# EAGLE design sensors (EAGLE 6.4)
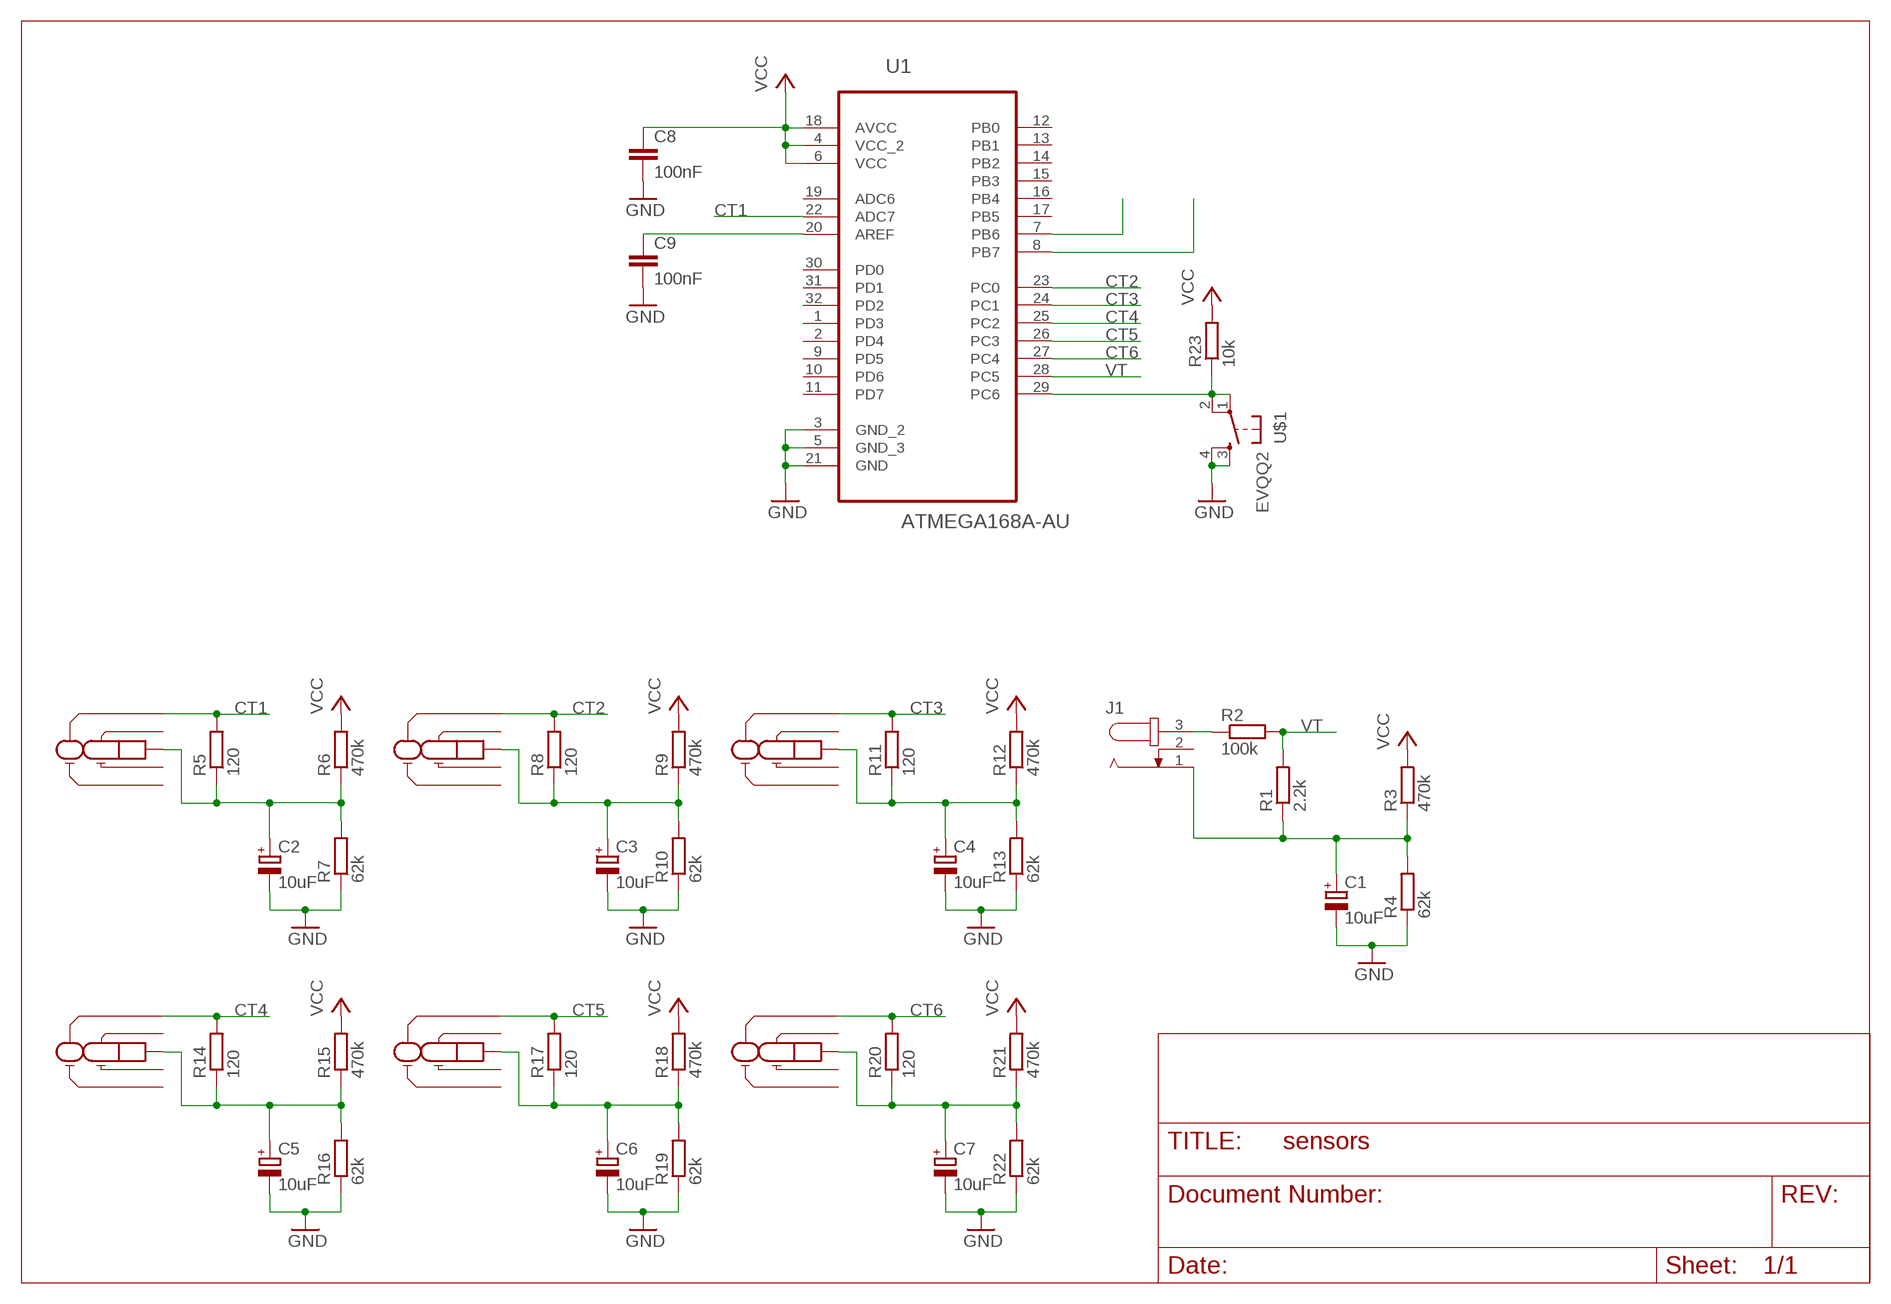
[diagram p0: schematic, sheet 1]

## Parts
C1  10uF  CPOL-EU153CLV-0405  [153CLV-0405]
C2  10uF  CPOL-EU153CLV-0405  [153CLV-0405]
C3  10uF  CPOL-EU153CLV-0405  [153CLV-0405]
C4  10uF  CPOL-EU153CLV-0405  [153CLV-0405]
C5  10uF  CPOL-EU153CLV-0405  [153CLV-0405]
C6  10uF  CPOL-EU153CLV-0405  [153CLV-0405]
C7  10uF  CPOL-EU153CLV-0405  [153CLV-0405]
C8  100nF  C-EUC1206  [C1206]
C9  100nF  C-EUC1206  [C1206]
J1  JACK-PLUG0  [SPC4077]
JC1  15428/BT  [15428/BT]
JC2  15428/BT  [15428/BT@1]
JC3  15428/BT  [15428/BT@1]
JC4  15428/BT  [15428/BT@1]
JC5  15428/BT  [15428/BT@1]
JC6  15428/BT  [15428/BT@1]
R1  2.2k  R-EU_R1206  [R1206]
R2  100k  R-EU_R1206  [R1206]
R3  470k  R-EU_R1206  [R1206]
R4  62k  R-EU_R1206  [R1206]
R5  120  R-EU_R1206  [R1206]
R6  470k  R-EU_R1206  [R1206]
R7  62k  R-EU_R1206  [R1206]
R8  120  R-EU_R1206  [R1206]
R9  470k  R-EU_R1206  [R1206]
R10  62k  R-EU_R1206  [R1206]
R11  120  R-EU_R1206  [R1206]
R12  470k  R-EU_R1206  [R1206]
R13  62k  R-EU_R1206  [R1206]
R14  120  R-EU_R1206  [R1206]
R15  470k  R-EU_R1206  [R1206]
R16  62k  R-EU_R1206  [R1206]
R17  120  R-EU_R1206  [R1206]
R18  470k  R-EU_R1206  [R1206]
R19  62k  R-EU_R1206  [R1206]
R20  120  R-EU_R1206  [R1206]
R21  470k  R-EU_R1206  [R1206]
R22  62k  R-EU_R1206  [R1206]
R23  10k  R-EU_R1206  [R1206]
U1  ATMEGA168A-AU  [QFP80P900X900X120-32N]
U$1  EVQQ2  [EVQQ2]

## Nets
AREF: C9.1 U1.20(AREF)
CT1: JC1.P2 R5.2 U1.22(ADC7)
CT2: JC2.P2 R8.2 U1.23(PC0)
CT3: JC3.P2 R11.2 U1.24(PC1)
CT4: JC4.P2 R14.2 U1.25(PC2)
CT5: JC5.P2 R17.2 U1.26(PC3)
CT6: JC6.P2 R20.2 U1.27(PC4)
GND: C1.- C2.- C3.- C4.- C5.- C6.- C7.- C8.2 C9.2 R4.1 R7.1 R10.1 R13.1 R16.1 R19.1 R22.1 U1.3(GND_2) U1.5(GND_3) U1.21(GND) U$1.3 U$1.4
N$1: J1.3 R2.1
N$2: C1.+ J1.1 R1.1 R3.1 R4.2
N$3: C2.+ JC1.P1 R5.1 R6.1 R7.2
N$4: C3.+ JC2.P1 R8.1 R9.1 R10.2
N$5: C4.+ JC3.P1 R11.1 R12.1 R13.2
N$6: C5.+ JC4.P1 R14.1 R15.1 R16.2
N$7: C6.+ JC5.P1 R17.1 R18.1 R19.2
N$8: C7.+ JC6.P1 R20.1 R21.1 R22.2
N$10: U1.7(PB6)
N$11: U1.8(PB7)
RESET: R23.1 U1.29(PC6) U$1.1 U$1.2
VCC: C8.1 R3.2 R6.2 R9.2 R12.2 R15.2 R18.2 R21.2 R23.2 U1.4(VCC_2) U1.6(VCC) U1.18(AVCC)
VT: R1.2 R2.2 U1.28(PC5)
Unconnected: J1.2 JC1.P3 JC1.P4 JC1.P5 JC2.P3 JC2.P4 JC2.P5 JC3.P3 JC3.P4 JC3.P5 JC4.P3 JC4.P4 JC4.P5 JC5.P3 JC5.P4 JC5.P5 JC6.P3 JC6.P4 JC6.P5 U1.1(PD3) U1.2(PD4) U1.9(PD5) U1.10(PD6) U1.11(PD7) U1.12(PB0) U1.13(PB1) U1.14(PB2) U1.15(PB3) U1.16(PB4) U1.17(PB5) U1.19(ADC6) U1.30(PD0) U1.31(PD1) U1.32(PD2)

## Library data of the parts
C1-C7 = rcl:CPOL-EU: POLARIZED CAPACITOR, European symbol
C8 C9 = rcl:C-EU: CAPACITOR, European symbol
J1 = con-jack:JACK-PLUG: DC POWER JACK Power Jack, DC, Right Angle, Through Hole, Rated 5A at 16VDC, PC Terminals Distributor: Farnell (www.Farnell.de) Drawing: 84N1161.pdf / 84N1162.pdf Manufacturer: SPC Technology (www.spctechnology.com) Type: SPC4077 / SPC 4078; OC_FARNELL: unknown; OC_NEWARK: unknown
JC1 = EnergyMonitoring:15428/BT: HEMBRA STEREO 3.5MM PCB PLASTICO
JC2-JC6 = Jack3.5:15428/BT: HEMBRA STEREO 3.5MM PCB PLASTICO
R1-R23 = rcl:R-EU_: RESISTOR, European symbol
U1 = Atmel_By_element14_Batch_1:ATMEGA168A-AU: MCU; DESCRIPTION: MCU; MPN: ATMEGA168A-AU; OC_FARNELL: 1841603; OC_NEWARK: 12T1295; PACKAGE: QFP-32; SUPPLIER: Atmel
U$1 = EnergyMonitoring:EVQQ2: 6 mm Square Thin Type SMD Light Touch Switch Datasheet <http://www.farnell.com/datasheets/578646.pdf>

## Board
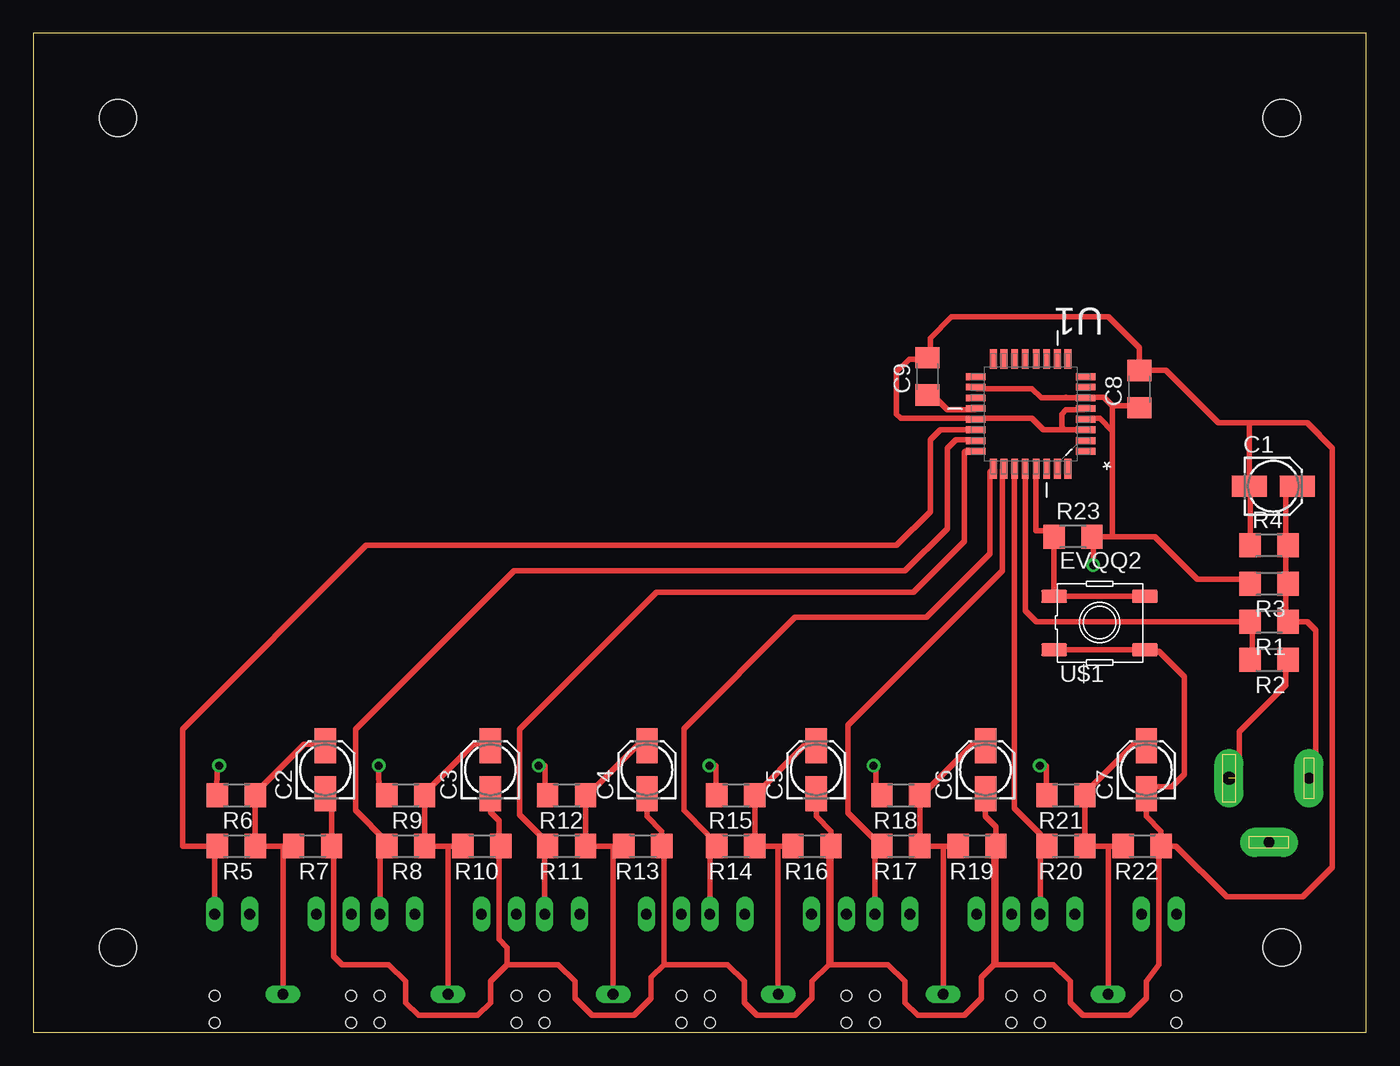
[diagram p1: board, top side]
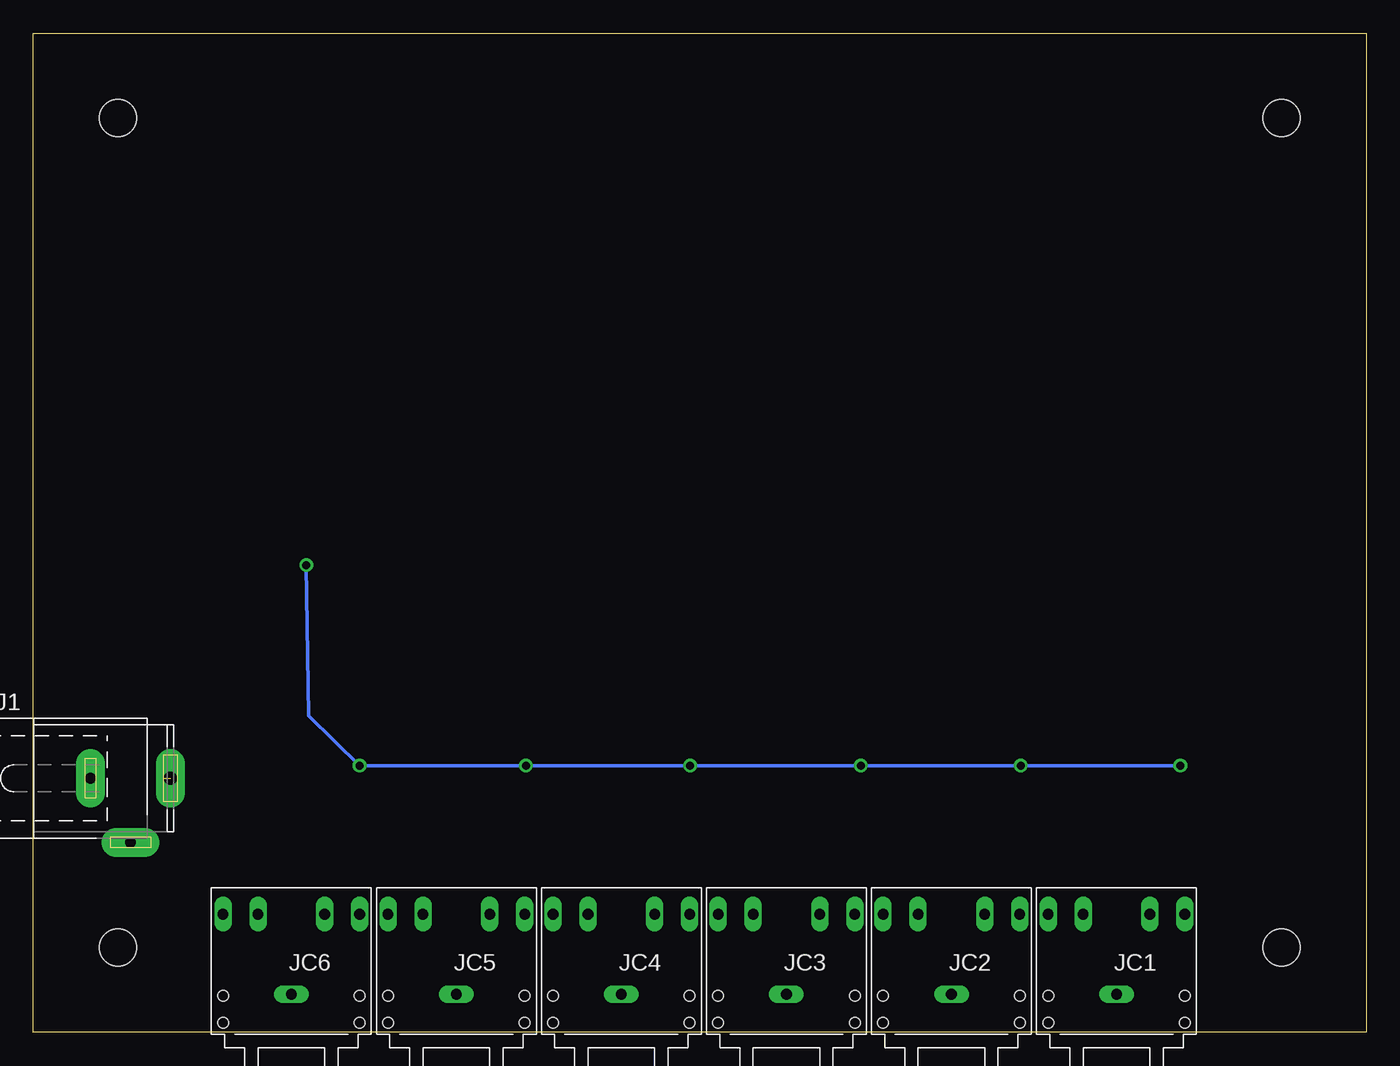
[diagram p2: board, bottom side, seen from below]

Size 100 x 74.92 mm. Coordinates in mm from the lower left corner, seen from the top.
Outline: 0,0 100,0 100,74.92 0,74.92 0,0
Copper layers (1*16): Top 0.035mm / dielectric 1.5mm / Bottom 0.035mm
Design rules "default": minimum track width 10mil, minimum drill 24mil, track to track 8mil, track to pad 8mil, pad to pad 8mil, via to via 8mil, smd to smd 8mil, copper to edge 40mil, drill to drill 8mil, minimum pad ring 10mil, minimum via ring 8mil, stop-mask expansion 4mil, vias tented up to drill 0mil, thermal gap 10mil
Holes 2.8 mm at 6.35,6.35 93.66,6.35 93.66,68.58 6.35,68.58

### Footprints (pad centres in the part's own frame; a part is rotated, then mirrored left to right if it is on the bottom)
153CLV-0405 = smd 2.6 x 1.6: + 1.8,0; - -1.8,0
C1206 = smd 1.6 x 1.8: 1 -1.4,0; 2 1.4,0
SPC4077 = drill 0.8 pad 2.184 long: 1 -3,0; 2 0,-4.8 | drill 1 pad 2.184 long: 3 3,0
15428/BT = drill 0.8 long: P1 0,0; P2 -5.125,-6; P3 -2.5,-6; P4 2.5,-6; P5 5.125,-6 | hole 0.8: 5.125,2.125; 5.125,0.125; -5.125,2.125; -5.125,0.125
R1206 = smd 1.6 x 1.803: 1 -1.422,0; 2 1.422,0
QFP80P900X900X120-32N = smd 1.473 x 0.508: 1 -4.115,2.794; 2 -4.115,2.007; 3 -4.115,1.194; 4 -4.115,0.406; 5 -4.115,-0.406; 6 -4.115,-1.194; 7 -4.115,-2.007; 8 -4.115,-2.794; 17 4.115,-2.794; 18 4.115,-2.007; 19 4.115,-1.194; 20 4.115,-0.406; 21 4.115,0.406; 22 4.115,1.194; 23 4.115,2.007; 24 4.115,2.794 | smd 0.508 x 1.473: 9 -2.794,-4.115; 10 -2.007,-4.115; 11 -1.194,-4.115; 12 -0.406,-4.115; 13 0.406,-4.115; 14 1.194,-4.115; 15 2.007,-4.115; 16 2.794,-4.115; 25 2.794,4.115; 26 2.007,4.115; 27 1.194,4.115; 28 0.406,4.115; 29 -0.406,4.115; 30 -1.194,4.115; 31 -2.007,4.115; 32 -2.794,4.115
EVQQ2 = smd 1.93 x 0.965: 1 -3.4,1.95; 2 3.4,1.95; 3 -3.4,-2.05; 4 3.4,-2.05

### Placement (x,y rotation side)
C1  93.03,40.96 0 top
C2  21.91,19.68 90 top
C3  34.29,19.68 90 top
C4  46.04,19.68 90 top
C5  58.74,19.68 90 top
C6  71.44,19.68 90 top
C7  83.5,19.68 90 top
C8  82.97,48.23 90 top
C9  67.1,49.19 90 top
J1  92.71,19.05 0 bottom
JC1  18.73,2.86 180 bottom
JC2  15428/BT  [15428/BT]  31.11,2.86 180 bottom
JC3  15428/BT  [15428/BT]  43.5,2.86 180 bottom
JC4  15428/BT  [15428/BT]  55.88,2.86 180 bottom
JC5  15428/BT  [15428/BT]  68.26,2.86 180 bottom
JC6  15428/BT  [15428/BT]  80.64,2.86 180 bottom
R1  92.71,30.8 180 top
R2  92.71,27.94 180 top
R3  92.71,33.66 180 top
R4  92.71,36.51 0 top
R5  15.24,13.97 180 top
R6  15.24,17.78 180 top
R7  20.95,13.97 180 top
R8  27.94,13.97 180 top
R9  27.94,17.78 180 top
R10  33.66,13.97 180 top
R11  40.01,13.97 180 top
R12  40.01,17.78 180 top
R13  45.72,13.97 180 top
R14  52.7,13.97 180 top
R15  52.7,17.78 180 top
R16  58.42,13.97 180 top
R17  65.09,13.97 180 top
R18  65.09,17.78 180 top
R19  70.8,13.97 180 top
R20  77.47,13.97 180 top
R21  77.47,17.78 180 top
R22  83.19,13.97 180 top
R23  78,37.17 0 top
U1  74.83,46.38 180 top
U$1  79.99,30.74 0 top

### Tracks (layer width: path | path; a pad name or v marks a point on that pad's centre or on a via)
AREF
  Top 0.406: C9.1 67.78,47.47 68.58,46.67 70.6,46.67 U1.20
CT1
  Top 0.406: JC1.P2 13.61,13.76 R5.2 11.2,13.97 11.2,22.74 24.97,36.51 64.77,36.51 67.31,39.05 67.31,44.45 68.05,45.19 U1.22
CT2
  Top 0.254: 26.04,13.97 R8.2 | 26.04,8.89 JC2.P2
  Top 0.406: 26.04,8.89 26.04,13.97 | R8.2 26.52,14.28 24.19,16.64 24.19,22.74 36.05,34.61 65.41,34.61 68.58,37.78 68.58,43.81 69.22,44.45 70.63,44.45 U1.23
CT3
  Top 0.406: JC3.P2 38.37,13.76 R11.2 38.58,14.22 36.48,16.32 36.48,22.74 46.76,33.02 66.04,33.02 69.85,36.83 69.85,43.5 69.94,43.59 U1.24
CT4
  Top 0.406: 51.44,13.97 R14.2 | R14.2 50.51,14.92 48.8,16.64 48.8,22.77 57.15,31.11 66.99,31.11 71.75,35.88 71.75,41.99 U1.25 | JC4.P2 50.76,13.44 R14.2
CT5
  Top 0.406: 64.14,13.97 R17.2 | R17.2 63.63,13.97 61.12,16.48 61.12,23.02 72.71,34.61 72.71,42.15 U1.26 | JC5.P2 63.14,13.44 R17.2
CT6
  Top 0.254: 75.56,13.97 R20.2 | 75.56,8.89 JC6.P2
  Top 0.406: 75.56,8.89 75.56,13.97 75.56,14.84 73.6,16.8 73.6,42.23 U1.27
GND
  Top 0.254: 45.72,17.78 C4.- | 91.2,36 R4.1 | 84,18.4 C7.- | 66.4,50.48 66.4,50.4 C9.2
  Top 0.406: 92,40.8 C1.- | 35.56,5.08 34.29,3.81 34.29,2.22 33.34,1.27 28.89,1.27 27.94,2.22 27.94,3.81 26.67,5.08 23.18,5.08 22.54,5.71 22.54,13.8 R7.1 22.38,17.42 C2.- | 34.92,13.5 R10.1 35.4,13.49 | C3.- 34.29,16.51 34.92,15.88 34.92,13.5 | 34.92,13.5 34.92,6.99 35.56,6.35 35.56,5.08 | 35.56,5.08 39.37,5.08 40.64,3.81 40.64,2.54 41.91,1.27 45.09,1.27 46.35,2.54 46.35,4.13 47.31,5.08 | R16.1 59.84,15.09 58.74,16.19 C5.- | C4.- 46.04,16.19 47.14,15.09 R13.1 47.31,13.82 47.31,5.08 | R19.1 72.22,15.4 71.44,16.19 C6.- | R22.1 84.61,15.09 83.5,16.19 C7.- | 47.31,5.08 52.07,5.08 53.34,3.81 53.34,2.22 54.29,1.27 57.15,1.27 58.42,2.54 58.42,3.81 59.69,5.08 | 59.69,5.08 59.69,13.82 R16.1 | R16.1 59.84,5.23 59.69,5.08 | 59.69,5.08 64.14,5.08 65.41,3.81 65.41,2.22 66.36,1.27 69.85,1.27 71.12,2.54 71.12,4.13 72.07,5.08 | 72.07,5.08 72.07,13.82 R19.1 | R19.1 72.22,5.23 72.07,5.08 | 72.07,5.08 76.52,5.08 77.79,3.81 77.79,2.22 78.74,1.27 82.23,1.27 83.5,2.54 83.5,3.81 84.45,5.08 84.45,13.82 R22.1 | 84,18.4 84.02,18.41 85.41,18.41 86.36,19.37 86.36,26.67 84.45,28.57 83.5,28.57 U$1.4 U$1.3 | 70.77,46.04 74.93,46.04 75.78,45.19 U1.3 77.37,45.19 77.15,45.4 77.15,46.35 77.47,46.67 78.83,46.67 U1.5 | 70.77,46.04 U1.21 | 91.12,45.72 88.9,45.72 84.98,49.63 C8.2 82.97,51.33 80.64,53.66 68.9,53.66 67.31,52.07 67.31,50.48 C9.2 | 91.12,45.72 95.57,45.72 97.47,43.81 97.47,12.38 95.25,10.16 89.53,10.16 85.72,13.97 R22.1 | C1.- 91.23,45.62 91.12,45.72 | 66.99,50.48 66.4,50.48 65.72,50.48 64.77,49.53 64.77,46.35 65.09,46.04 70.77,46.04 | R4.1 91.29,40.9 C1.-
N$1  (1 unrouted)
  Top 0.406: 90.17,19.05 90.49,19.37 90.49,22.54 93.98,26.04 93.98,27.79 R2.1
N$2
  Top 0.254: 93.98,40.96 C1.+ | 93.98,37.15 R4.2 93.98,36.83 | 93.98,33.02 R3.1 93.98,34.29 | 93.98,30.8 R1.1
  Top 0.406: 93.98,37.15 93.98,40.96 | 93.98,33.02 93.98,30.8 95.57,30.8 96.2,30.16 96.2,19.05 J1.1 | 93.98,36.83 93.98,34.29
N$3
  Top 0.406: JC1.P1 18.73,13.97 R7.2 R5.1 R6.1 16.66,17.93 20.32,21.59 21.8,21.59 C2.+
N$4
  Top 0.254: 31.11,2.54 JC2.P1
  Top 0.406: JC2.P1 31.11,13.97 | 31.11,13.97 R8.1 R9.1 29.36,17.93 33.02,21.59 34.19,21.59 C3.+ | 31.11,13.97 R10.2
N$5
  Top 0.406: 43.5,13.97 R11.1 R12.1 41.59,17.78 45.4,21.59 45.93,21.59 C4.+ | 43.5,13.97 R13.2 | JC3.P1 43.5,13.97
N$6
  Top 0.254: 53.98,13.97 R14.1
  Top 0.406: JC4.P1 55.88,13.97 R16.2 R14.1 R15.1 57.83,21.48 C5.+
N$7
  Top 0.254: 66.67,13.97 R17.1
  Top 0.406: JC5.P1 68.26,13.97 R19.2 66.67,13.97 | R17.1 R18.1 66.67,17.78 70.48,21.59 71.33,21.59 C6.+
N$8
  Top 0.406: JC6.P1 80.64,13.97 R22.2 R20.1 R21.1 78.89,17.93 82.55,21.59 83.4,21.59 C7.+
RESET
  Top 0.254: 75.2,41.6 U1.29 | 76,37.6 R23.1
  Top 0.406: 75.31,42.19 U1.29 | 75.2,41.6 75.2,37.6 76,37.6 | R23.1 76.58,32.7 U$1.1 U$1.2
VCC  (via drill 0.61)
  Top 0.254: 80,37.6 R23.2 79.52,37.12 | 90.86,33.47 91.2,33.77 R3.2 | v13.94,20 13.78,20 | 13.77,17.77 R6.2 | 25.93,17.77 R9.2 | v37.92,20 38.4,20 | 38.4,18.4 R12.2 | v50.72,20 51.2,20 | 51.2,18.4 R15.2 | v63.03,20 63.2,20 | 63.2,18.4 R18.2 | 76,18.4 R21.2
  Top 0.406: 13.78,20 13.77,17.77 | 25.93,17.77 v25.92,20 | 38.4,20 38.4,18.4 | 51.2,20 51.2,18.4 | 63.2,20 63.2,18.4 | 76,18.4 76,20 v75.52,20 | v79.52,35.03 79.52,37.12 | 80.96,37.15 84.14,37.15 87.31,33.97 90.97,33.97 R3.2 | U1.6 75.62,47.57 74.93,48.26 70.84,48.26 U1.18 | U1.6 77.52,47.57 77.47,47.62 | 78.88,46.04 U1.4 79,46.04 80.01,46.04 80.96,45.09 | 80,37.6 80,37.45 79.69,37.15 80.96,37.15 | 80.96,37.15 80.96,45.09 | 80.96,45.09 80.96,46.99 | 80.96,46.99 80.33,47.62 78.99,47.62 U1.6 | 80.96,46.99 82.82,46.99 C8.1
  Bottom 0.254: v13.94,20 v25.92,20 v37.92,20 v50.72,20 v63.03,20 v75.52,20 79.33,23.73 v79.52,35.03
VT
  Top 0.254: 91.44,28.26 R2.2 | 91.44,30.8 R1.2
  Top 0.406: 91.44,30.8 91.44,28.26 | U1.28 74.42,31.63 75.25,30.8 R1.2